# Altium schematic sheet User_interface.SchDoc
size A4
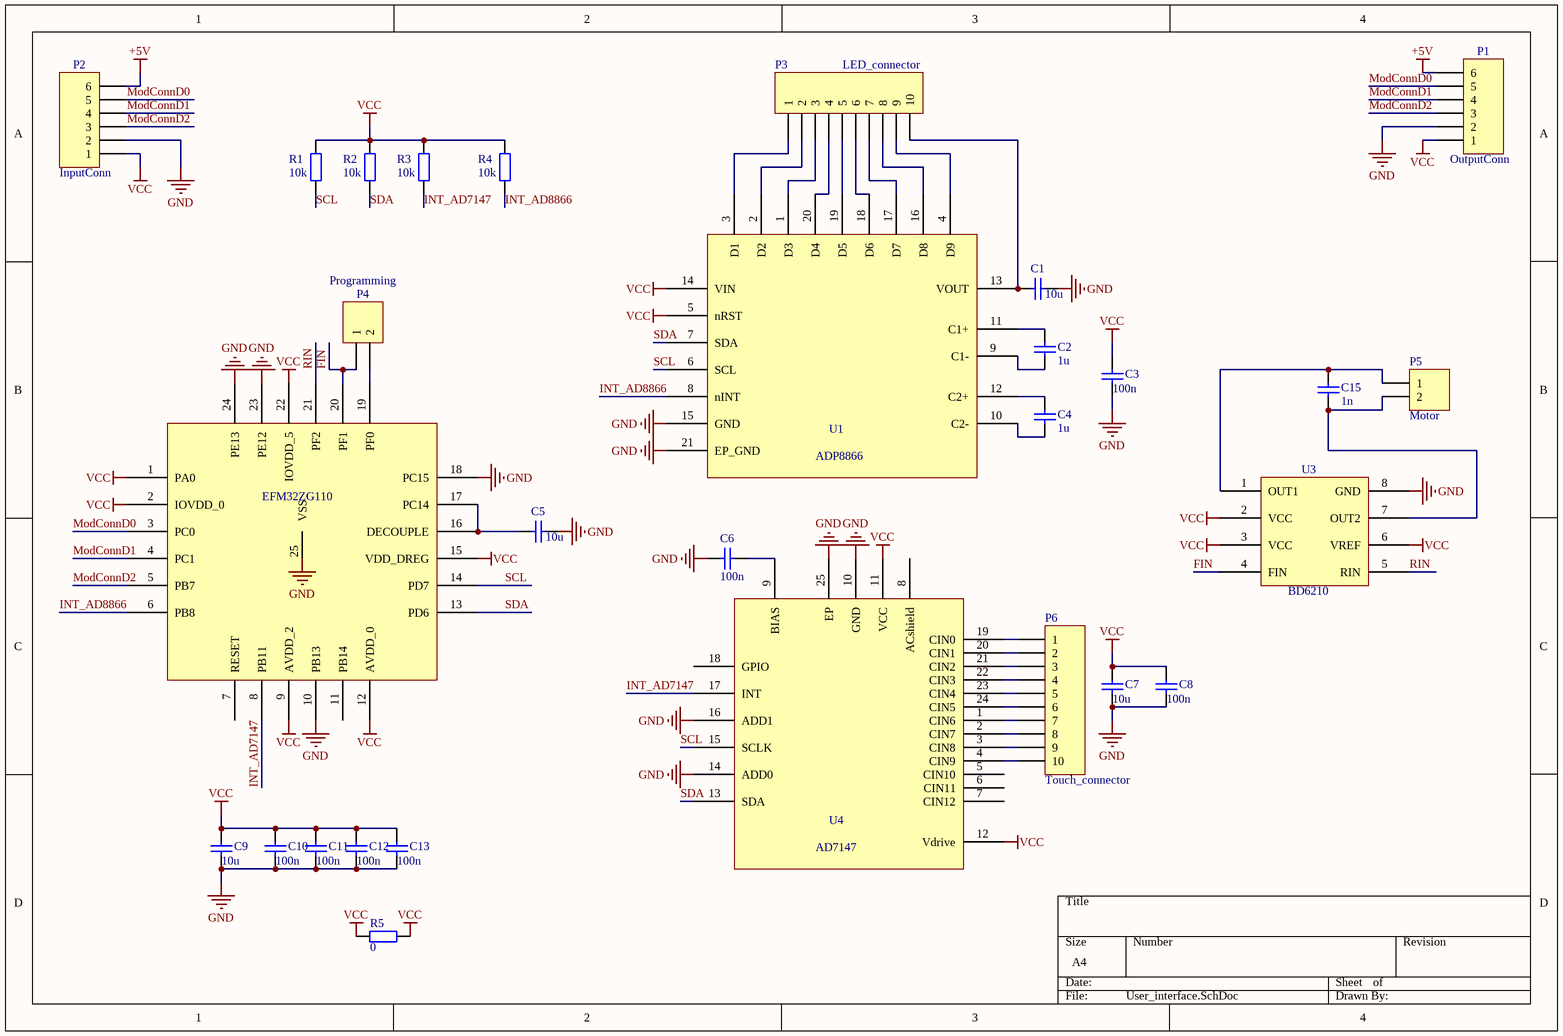
[diagram p0: User_interface.SchDoc]

## Parts
C1  10u  [0805]
C2  value 1u  [0805]  (hidden comment: 10u)
C3  value 100n  [0402]  (hidden comment: Cap Semi)
C4  value 1u  [0805]  (hidden comment: 10u)
C5  10u  [0805]
C6  value 100n  [0402]  (hidden comment: Cap Semi)
C7  10u  [0805]
C8  value 100n  [0402]  (hidden comment: Cap Semi)
C9  10u  [0805]
C10  value 100n  [0402]  (hidden comment: Cap Semi)
C11  value 100n  [0402]  (hidden comment: Cap Semi)
C12  value 100n  [0402]  (hidden comment: Cap Semi)
C13  value 100n  [0402]  (hidden comment: Cap Semi)
C15  value 1n  [0805]  (hidden comment: Cap Semi)
P1  OutputConn  [Goldpin6_1.27mm]
P2  InputConn  [Goldpin6_1.27mm]
P3  LED_connector  [User_interface_10pin_connector]
P4  Programming  [GeckoProgramming]
P5  Motor  [GeckoProgramming]
P6  Touch_connector  [User_interface_10pin_connector]
R1  value 10k  [0402]  (hidden comment: Res2)
R2  value 10k  [0402]  (hidden comment: Res2)
R3  value 10k  [0402]  (hidden comment: Res2)
R4  value 10k  [0402]  (hidden comment: Res2)
R5  value 0  [1206]  (hidden comment: Res2)
U1  ADP8866  [QFN20_4x4x0.5]
U2  EFM32ZG110  [QFN24_5x5_0.65]
U3  BD6210  [SOT8]
U4  AD7147  [QFN24_4x4]

## Nets
+5V: P1.6 P2.6
GND: C1.1 C3.1 C5.1 C6.2 C7.1 C8.1 C9.1 C10.1 C11.1 C12.1 C13.1 P1.2 P2.2 U1.15(GND) U1.21(EP_GND) U2.10(PB13) U2.18(PC15) U2.23(PE12) U2.24(PE13) U2.25(VSS) U3.8(GND) U4.10(GND) U4.14(ADD0) U4.16(ADD1) U4.25(EP)
VCC: C3.2 C7.2 C8.2 C9.2 C10.2 C11.2 C12.2 C13.2 P1.1 P2.1 R1.2 R2.2 R3.2 R4.2 R5.1 R5.2 U1.5(nRST) U1.14(VIN) U2.1(PA0) U2.2(IOVDD_0) U2.9(AVDD_2) U2.12(AVDD_0) U2.15(VDD_DREG) U2.22(IOVDD_5) U3.2(VCC) U3.3(VCC) U3.6(VREF) U4.11(VCC) U4.12(Vdrive)
FIN: P4.1 U2.20(PF1) U3.4(FIN)
INT_AD7147: R3.1 U2.8(PB11) U4.17(INT)
INT_AD8866: R4.1 U1.8(nINT) U2.6(PB8)
ModConnD0: P1.5 P2.5 U2.3(PC0)
ModConnD1: P1.4 P2.4 U2.4(PC1)
ModConnD2: P1.3 P2.3 U2.5(PB7)
RIN: U2.21(PF2) U3.5(RIN)
SCL: R1.1 U1.6(SCL) U2.14(PD7) U4.15(SCLK)
SDA: R2.1 U1.7(SDA) U2.13(PD6) U4.13(SDA)
NetC1_2: C1.2 P3.10 U1.13(VOUT)
NetC2_1: C2.1 U1.11(C1+)
NetC2_2: C2.2 U1.9(C1-)
NetC4_1: C4.1 U1.12(C2+)
NetC4_2: C4.2 U1.10(C2-)
NetC5_2: C5.2 U2.16(DECOUPLE) U2.17(PC14)
NetC6_1: C6.1 U4.9(BIAS)
NetC15_1: C15.1 P5.1 U3.1(OUT1)
NetC15_2: C15.2 P5.2 U3.7(OUT2)
NetP3_1: P3.1 U1.3(D1)
NetP3_2: P3.2 U1.2(D2)
NetP3_3: P3.3 U1.1(D3)
NetP3_4: P3.4 U1.20(D4)
NetP3_5: P3.5 U1.19(D5)
NetP3_6: P3.6 U1.18(D6)
NetP3_7: P3.7 U1.17(D7)
NetP3_8: P3.8 U1.16(D8)
NetP3_9: P3.9 U1.4(D9)
NetP4_2: P4.2 U2.19(PF0)
NetP6_1: P6.1 U4.19(CIN0)
NetP6_2: P6.2 U4.20(CIN1)
NetP6_3: P6.3 U4.21(CIN2)
NetP6_4: P6.4 U4.22(CIN3)
NetP6_5: P6.5 U4.23(CIN4)
NetP6_6: P6.6 U4.24(CIN5)
NetP6_7: P6.7 U4.1(CIN6)
NetP6_8: P6.8 U4.2(CIN7)
NetP6_9: P6.9 U4.3(CIN8)
NetP6_10: P6.10 U4.4(CIN9)

Not connected (* = marked no-connect by the designer): U2 7(RESET) 11(PB14); U4 5(CIN10) 6(CIN11) 7(CIN12) 8(ACshield) 18(GPIO)

## Library data of the parts
C1-C13 C15 = Cap Semi: Capacitor (Semiconductor SIM Model); Published: 8-Jun-2000; LatestRevisionDate: 29-May-2009; LatestRevisionNote: IPC-7351 Footprint Added.; PackageReference: C1206; Publisher: Altium Limited; PackageDescription: Chip Capacitor
  C1 C5 C7 C9: Value: 10u
P1 P2 = MHDR1X6: Header, 6-Pin; LatestRevisionDate: 17-Jul-2002; LatestRevisionNote: Re-released for DXP Platform.; Publisher: Altium Limited
P3 P6 = Header 10: Header, 10-Pin; LatestRevisionDate: 17-Jul-2002; LatestRevisionNote: Re-released for DXP Platform.; Publisher: Altium Limited
P4 P5 = MHDR1X2: Header, 2-Pin; LatestRevisionDate: 17-Jul-2002; LatestRevisionNote: Re-released for DXP Platform.; Publisher: Altium Limited
R1-R5 = Res2: Resistor; Published: 8-Jun-2000; LatestRevisionDate: 17-Jul-2002; LatestRevisionNote: Re-released for DXP Platform.; PackageReference: AXIAL-0.4; Publisher: Altium Limited; PackageDescription: Axial Device, Thru-Hole; 2 Leads; 0.4 in Pin Spacing